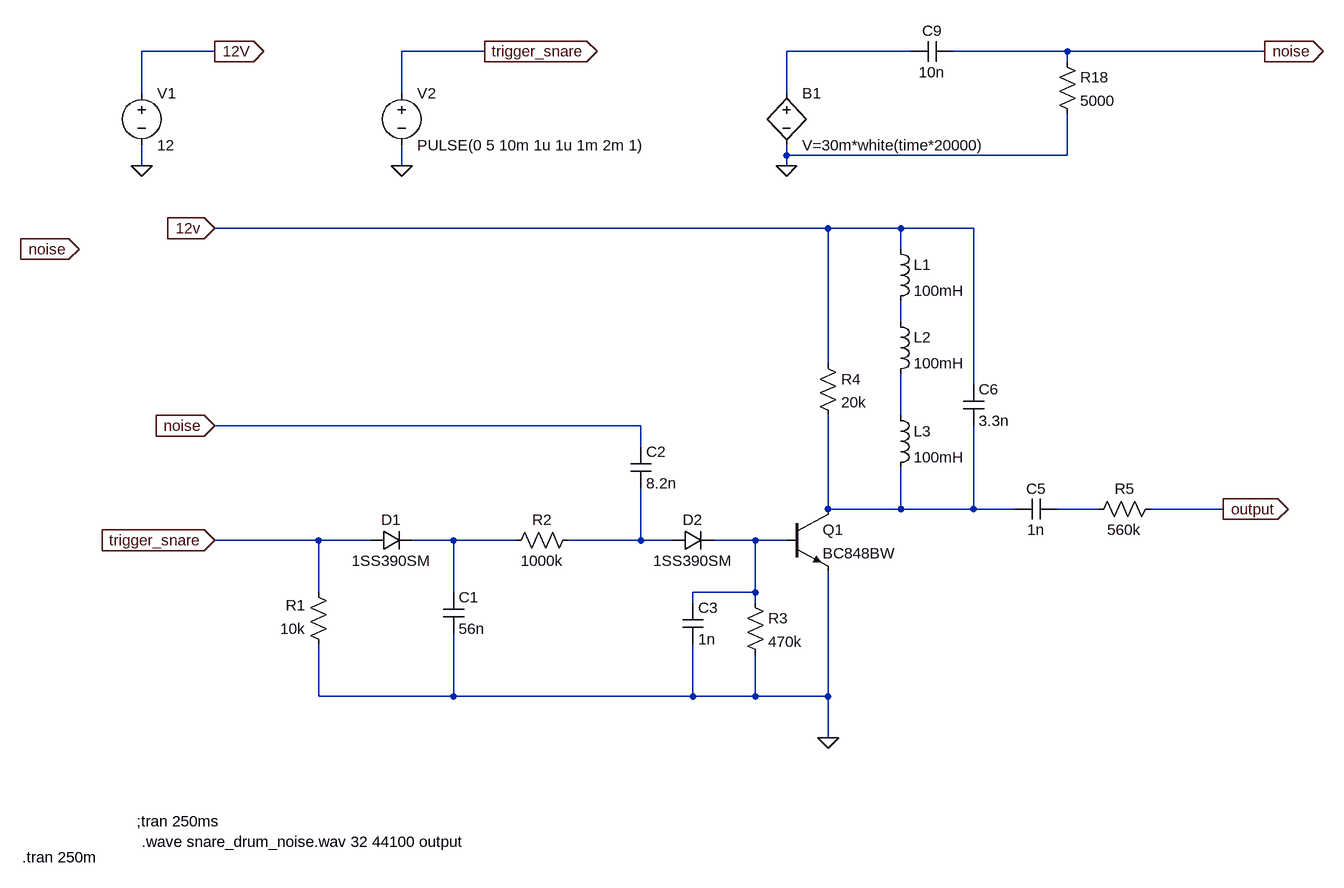
[diagram p0: schematic snare_drum_noise.asc]
snare_drum_noise.asc, the LTspice schematic file:
Version 4
SHEET 1 2960 680
WIRE 752 -880 640 -880
WIRE 1168 -880 1040 -880
WIRE 1824 -880 1632 -880
WIRE 2064 -880 1888 -880
WIRE 2368 -880 2064 -880
WIRE 2064 -864 2064 -880
WIRE 640 -816 640 -880
WIRE 1040 -816 1040 -880
WIRE 1632 -816 1632 -880
WIRE 1632 -720 1632 -736
WIRE 2064 -720 2064 -784
WIRE 2064 -720 1632 -720
WIRE 640 -704 640 -736
WIRE 1040 -704 1040 -736
WIRE 1632 -704 1632 -720
WIRE 1696 -608 752 -608
WIRE 1808 -608 1696 -608
WIRE 1920 -608 1808 -608
WIRE 1808 -576 1808 -608
WIRE 1808 -464 1808 -496
WIRE 1696 -400 1696 -608
WIRE 1920 -368 1920 -608
WIRE 1808 -320 1808 -384
WIRE 1408 -304 752 -304
WIRE 1408 -272 1408 -304
WIRE 1696 -176 1696 -320
WIRE 1808 -176 1808 -240
WIRE 1808 -176 1696 -176
WIRE 1920 -176 1920 -304
WIRE 1920 -176 1808 -176
WIRE 1984 -176 1920 -176
WIRE 2112 -176 2048 -176
WIRE 2304 -176 2192 -176
WIRE 912 -128 752 -128
WIRE 992 -128 912 -128
WIRE 1120 -128 1056 -128
WIRE 1216 -128 1120 -128
WIRE 1408 -128 1408 -208
WIRE 1408 -128 1296 -128
WIRE 1456 -128 1408 -128
WIRE 1584 -128 1520 -128
WIRE 1632 -128 1584 -128
WIRE 912 -48 912 -128
WIRE 1120 -48 1120 -128
WIRE 1584 -48 1584 -128
WIRE 1584 -48 1488 -48
WIRE 1488 -32 1488 -48
WIRE 1584 -32 1584 -48
WIRE 912 112 912 32
WIRE 1120 112 1120 16
WIRE 1120 112 912 112
WIRE 1488 112 1488 32
WIRE 1488 112 1120 112
WIRE 1584 112 1584 48
WIRE 1584 112 1488 112
WIRE 1696 112 1696 -80
WIRE 1696 112 1584 112
WIRE 1696 176 1696 112
FLAG 752 -880 12V
IOPIN 752 -880 Out
FLAG 640 -704 0
FLAG 1168 -880 trigger_snare
IOPIN 1168 -880 Out
FLAG 1040 -704 0
FLAG 752 -608 12v
IOPIN 752 -608 In
FLAG 752 -128 trigger_snare
IOPIN 752 -128 In
FLAG 2304 -176 output
IOPIN 2304 -176 Out
FLAG 1632 -704 0
FLAG 2368 -880 noise
IOPIN 2368 -880 Out
FLAG 544 -576 noise
IOPIN 544 -576 In
FLAG 1696 176 0
FLAG 752 -304 noise
IOPIN 752 -304 In
SYMBOL voltage 640 -832 R0
WINDOW 123 0 0 Left 0
WINDOW 39 0 0 Left 0
SYMATTR InstName V1
SYMATTR Value 12
SYMBOL voltage 1040 -832 R0
WINDOW 123 0 0 Left 0
WINDOW 39 0 0 Left 0
SYMATTR InstName V2
SYMATTR Value PULSE(0 5 10m 1u 1u 1m 2m 1)
SYMBOL bv 1632 -832 R0
SYMATTR InstName B1
SYMATTR Value V=30m*white(time*20000)
SYMBOL cap 1888 -896 R90
WINDOW 0 0 32 VBottom 2
WINDOW 3 32 32 VTop 2
SYMATTR InstName C9
SYMATTR Value 10n
SYMBOL res 2048 -880 R0
SYMATTR InstName R18
SYMATTR Value 5000
SYMBOL res 928 48 R180
WINDOW 0 36 76 Left 2
WINDOW 3 36 40 Left 2
SYMATTR InstName R1
SYMATTR Value 10k
SYMBOL diode 992 -112 R270
WINDOW 0 32 32 VTop 2
WINDOW 3 0 32 VBottom 2
SYMATTR InstName D1
SYMATTR Value 1SS390SM
SYMBOL cap 1104 -48 R0
SYMATTR InstName C1
SYMATTR Value 56n
SYMBOL res 1312 -144 R90
WINDOW 0 0 56 VBottom 2
WINDOW 3 32 56 VTop 2
SYMATTR InstName R2
SYMATTR Value 1000k
SYMBOL cap 1392 -272 R0
SYMATTR InstName C2
SYMATTR Value 8.2n
SYMBOL diode 1456 -112 R270
WINDOW 0 32 32 VTop 2
WINDOW 3 0 32 VBottom 2
SYMATTR InstName D2
SYMATTR Value 1SS390SM
SYMBOL res 1568 -48 R0
SYMATTR InstName R3
SYMATTR Value 470k
SYMBOL cap 1472 -32 R0
SYMATTR InstName C3
SYMATTR Value 1n
SYMBOL npn 1632 -176 R0
SYMATTR InstName Q1
SYMATTR Value BC848BW
SYMBOL res 1680 -416 R0
SYMATTR InstName R4
SYMATTR Value 20k
SYMBOL cap 2048 -192 R90
WINDOW 0 0 32 VBottom 2
WINDOW 3 32 32 VTop 2
SYMATTR InstName C5
SYMATTR Value 1n
SYMBOL res 2096 -160 R270
WINDOW 0 32 56 VTop 2
WINDOW 3 0 56 VBottom 2
SYMATTR InstName R5
SYMATTR Value 560k
SYMBOL ind 1792 -480 R0
SYMATTR InstName L2
SYMATTR Value 100mH
SYMATTR SpiceLine Rser=82
SYMBOL cap 1904 -368 R0
SYMATTR InstName C6
SYMATTR Value 3.3n
SYMBOL ind 1792 -592 R0
SYMATTR InstName L1
SYMATTR Value 100mH
SYMATTR SpiceLine Rser=82
SYMBOL ind 1792 -336 R0
SYMATTR InstName L3
SYMATTR Value 100mH
SYMATTR SpiceLine Rser=82
TEXT 632 304 Left 2 !;tran 250ms
TEXT 640 336 Left 2 !.wave snare_drum_noise.wav 32 44100 output
TEXT 456 360 Left 2 !.tran 250m

The netlist it stands for:
* snare_drum_noise.asc
V1 12V 0 12
V2 trigger_snare 0 PULSE(0 5 10m 1u 1u 1m 2m 1)
B1 N001 0 V=30m*white(time*20000)
C9 noise N001 10n
R18 noise 0 5000
R1 0 trigger_snare 10k
D1 trigger_snare N006 1SS390SM
C1 N006 0 56n
R2 N007 N006 1000k
C2 noise N007 8.2n
D2 N007 N008 1SS390SM
R3 N008 0 470k
C3 N008 0 1n
Q1 N004 N008 0 0 BC848BW
R4 12V N004 20k
C5 N005 N004 1n
R5 N005 output 560k
L2 N002 N003 100mH Rser=82
C6 12V N004 3.3n
L1 12V N002 100mH Rser=82
L3 N003 N004 100mH Rser=82
.model D D
.lib standard.dio
.model NPN NPN
.model PNP PNP
.lib standard.bjt
;tran 250ms
.wave snare_drum_noise.wav 32 44100 output
.tran 250m
.backanno
.end